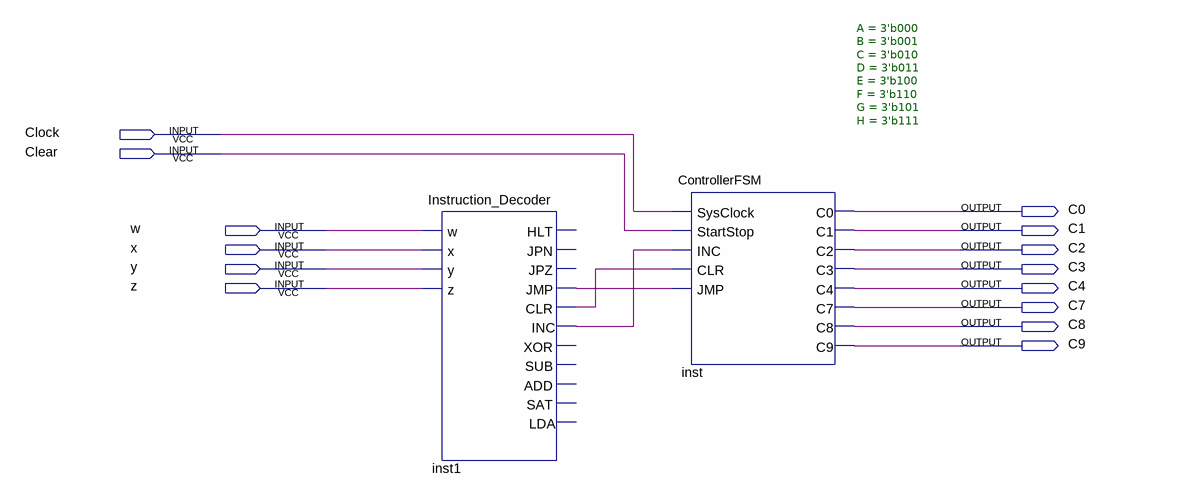
[diagram p0: schematic sheet]
// Quartus schematic TRISC_Controller.bdf as structural Verilog: 2 symbols, 14 pins
module TRISC_Controller (
  input  Clock,
  input  Clear,
  input  w,
  input  x,
  input  y,
  input  z,
  output C0,
  output C1,
  output C2,
  output C3,
  output C4,
  output C7,
  output C8,
  output C9
);

  wire inst1_clr, inst1_inc, inst1_jmp;

  Instruction_Decoder inst1 (
    .w(w), .x(x), .y(y), .z(z), .JMP(inst1_jmp), .CLR(inst1_clr), .INC(inst1_inc));  // open: HLT, JPN, JPZ, XOR, SUB, ADD, SAT, LDA
  ControllerFSM #(.A(3'b000), .B(3'b001), .C(3'b010), .D(3'b011), .E(3'b100), .F(3'b110), .G(3'b101), .H(3'b111)) inst (
    .SysClock(Clock), .StartStop(Clear), .INC(inst1_inc), .CLR(inst1_clr), .JMP(inst1_jmp), .C0(C0), .C1(C1),
    .C2(C2), .C3(C3), .C4(C4), .C7(C7), .C8(C8), .C9(C9));
endmodule
